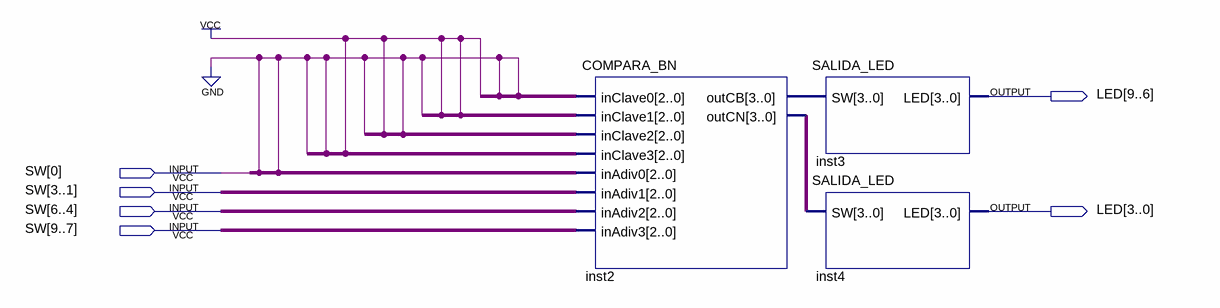
[diagram p0: schematic sheet]
// Quartus schematic tarea1.bdf as structural Verilog: 3 symbols, 6 pins
module tarea1 (
  input  [9:0] SW,
  output [9:0] LED
);

  wire [3:0] inst2_outcb, inst2_outcn;

  COMPARA_BN inst2 (
    .inClave0(3'b100), .inClave1(3'b011), .inClave2(3'b010), .inClave3(3'b001), .inAdiv0({SW[0], 2'b00}),
    .inAdiv1(SW[3:1]), .inAdiv2(SW[6:4]), .inAdiv3(SW[9:7]), .outCB(inst2_outcb), .outCN(inst2_outcn));
  SALIDA_LED inst3 (.SW(inst2_outcb), .LED(LED[9:6]));
  SALIDA_LED inst4 (.SW(inst2_outcn), .LED(LED[3:0]));

  // Other names for the same wires on the sheet: inAdiv0[0] = SW[0]; inAdiv1[2:0] = {SW[1], SW[2], SW[3]};
  //   inAdiv2[2:0] = {SW[4], SW[5], SW[6]}; inAdiv3[2:0] = {SW[7], SW[8], SW[9]}
endmodule
